# EAGLE design QFP64 breakout (EAGLE 5.11)
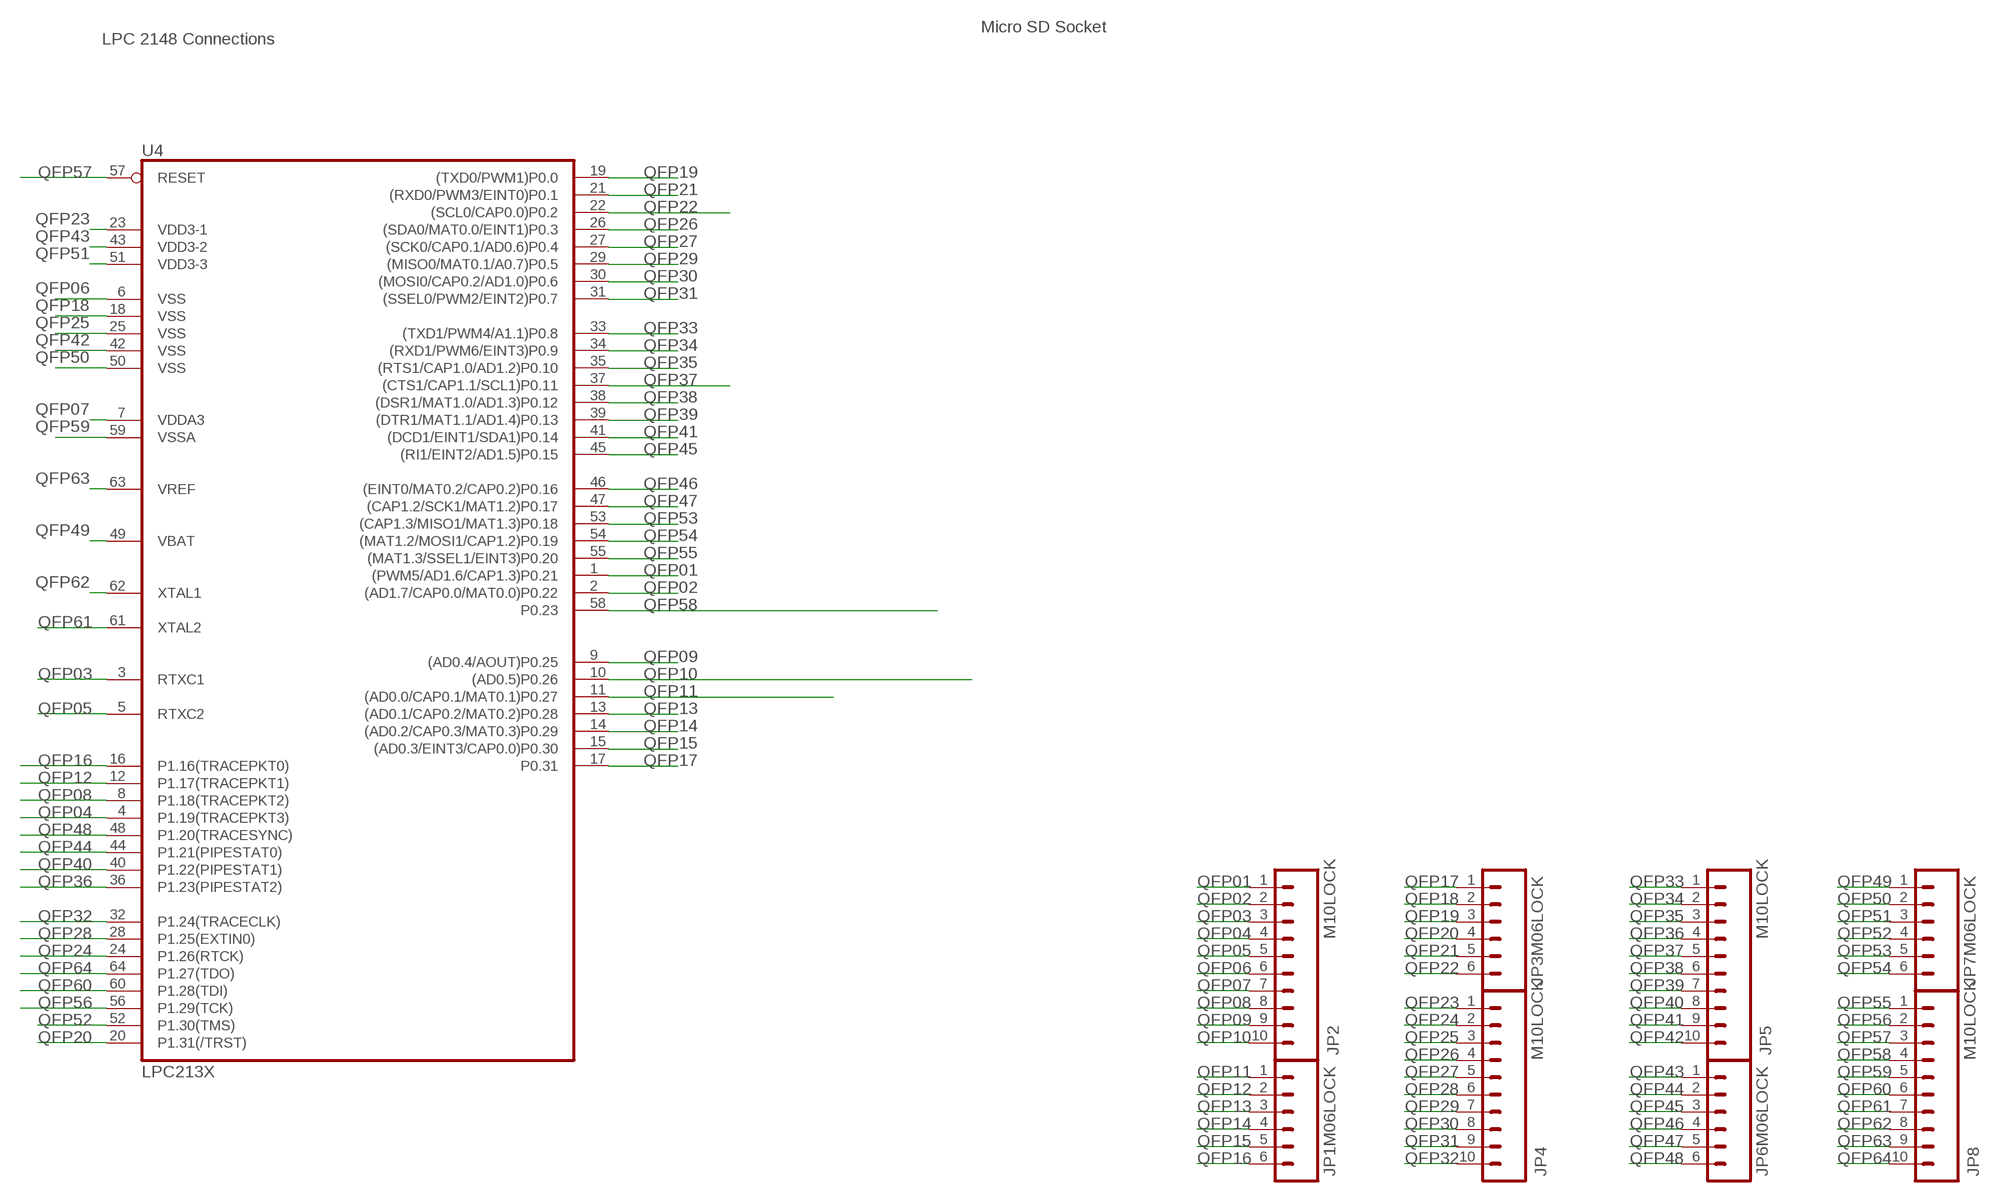
[diagram p0: schematic, sheet 1]

## Parts
JP1  M06LOCK  [1X06_LOCK]
JP2  M10LOCK  [1X10_LOCK]
JP3  M06LOCK  [1X06_LOCK]
JP4  M10LOCK  [1X10_LOCK]
JP5  M10LOCK  [1X10_LOCK]
JP6  M06LOCK  [1X06_LOCK]
JP7  M06LOCK  [1X06_LOCK]
JP8  M10LOCK  [1X10_LOCK]
U4  LPC213X  [SQFP-S-10X10-64]

## Nets
QFP01: JP2.1 U4.1((PWM5/AD1.6/CAP1.3)P0.21)
QFP02: JP2.2 U4.2((AD1.7/CAP0.0/MAT0.0)P0.22)
QFP03: JP2.3 U4.3(RTXC1)
QFP04: JP2.4 U4.4(P1.19(TRACEPKT3))
QFP05: JP2.5 U4.5(RTXC2)
QFP06: JP2.6 U4.6(VSS)
QFP07: JP2.7 U4.7(VDDA3)
QFP08: JP2.8 U4.8(P1.18(TRACEPKT2))
QFP09: JP2.9 U4.9((AD0.4/AOUT)P0.25)
QFP10: JP2.10 U4.10((AD0.5)P0.26)
QFP11: JP1.1 U4.11((AD0.0/CAP0.1/MAT0.1)P0.27)
QFP12: JP1.2 U4.12(P1.17(TRACEPKT1))
QFP13: JP1.3 U4.13((AD0.1/CAP0.2/MAT0.2)P0.28)
QFP14: JP1.4 U4.14((AD0.2/CAP0.3/MAT0.3)P0.29)
QFP15: JP1.5 U4.15((AD0.3/EINT3/CAP0.0)P0.30)
QFP16: JP1.6 U4.16(P1.16(TRACEPKT0))
QFP17: JP3.1 U4.17(P0.31)
QFP18: JP3.2 U4.18(VSS)
QFP19: JP3.3 U4.19((TXD0/PWM1)P0.0)
QFP20: JP3.4 U4.20(P1.31(/TRST))
QFP21: JP3.5 U4.21((RXD0/PWM3/EINT0)P0.1)
QFP22: JP3.6 U4.22((SCL0/CAP0.0)P0.2)
QFP23: JP4.1 U4.23(VDD3-1)
QFP24: JP4.2 U4.24(P1.26(RTCK))
QFP25: JP4.3 U4.25(VSS)
QFP26: JP4.4 U4.26((SDA0/MAT0.0/EINT1)P0.3)
QFP27: JP4.5 U4.27((SCK0/CAP0.1/AD0.6)P0.4)
QFP28: JP4.6 U4.28(P1.25(EXTIN0))
QFP29: JP4.7 U4.29((MISO0/MAT0.1/A0.7)P0.5)
QFP30: JP4.8 U4.30((MOSI0/CAP0.2/AD1.0)P0.6)
QFP31: JP4.9 U4.31((SSEL0/PWM2/EINT2)P0.7)
QFP32: JP4.10 U4.32(P1.24(TRACECLK))
QFP33: JP5.1 U4.33((TXD1/PWM4/A1.1)P0.8)
QFP34: JP5.2 U4.34((RXD1/PWM6/EINT3)P0.9)
QFP35: JP5.3 U4.35((RTS1/CAP1.0/AD1.2)P0.10)
QFP36: JP5.4 U4.36(P1.23(PIPESTAT2))
QFP37: JP5.5 U4.37((CTS1/CAP1.1/SCL1)P0.11)
QFP38: JP5.6 U4.38((DSR1/MAT1.0/AD1.3)P0.12)
QFP39: JP5.7 U4.39((DTR1/MAT1.1/AD1.4)P0.13)
QFP40: JP5.8 U4.40(P1.22(PIPESTAT1))
QFP41: JP5.9 U4.41((DCD1/EINT1/SDA1)P0.14)
QFP42: JP5.10 U4.42(VSS)
QFP43: JP6.1 U4.43(VDD3-2)
QFP44: JP6.2 U4.44(P1.21(PIPESTAT0))
QFP45: JP6.3 U4.45((RI1/EINT2/AD1.5)P0.15)
QFP46: JP6.4 U4.46((EINT0/MAT0.2/CAP0.2)P0.16)
QFP47: JP6.5 U4.47((CAP1.2/SCK1/MAT1.2)P0.17)
QFP48: JP6.6 U4.48(P1.20(TRACESYNC))
QFP49: JP7.1 U4.49(VBAT)
QFP50: JP7.2 U4.50(VSS)
QFP51: JP7.3 U4.51(VDD3-3)
QFP52: JP7.4 U4.52(P1.30(TMS))
QFP53: JP7.5 U4.53((CAP1.3/MISO1/MAT1.3)P0.18)
QFP54: JP7.6 U4.54((MAT1.2/MOSI1/CAP1.2)P0.19)
QFP55: JP8.1 U4.55((MAT1.3/SSEL1/EINT3)P0.20)
QFP56: JP8.2 U4.56(P1.29(TCK))
QFP57: JP8.3 U4.57(RESET)
QFP58: JP8.4 U4.58(P0.23)
QFP59: JP8.5 U4.59(VSSA)
QFP60: JP8.6 U4.60(P1.28(TDI))
QFP61: JP8.7 U4.61(XTAL2)
QFP62: JP8.8 U4.62(XTAL1)
QFP63: JP8.9 U4.63(VREF)
QFP64: JP8.10 U4.64(P1.27(TDO))

## Notes on the sheet
- Micro SD Socket
- LPC 2148 Connections

## Library data of the parts
JP1 JP3 JP6 JP7 = SparkFun:M06: Header 6 Standard 6-pin 0.1" header. Use with straight break away headers (SKU : PRT-00116), right angle break away headers (PRT-00553), swiss pins (PRT-00743), machine pins (PRT-00117), and female headers (PRT-00115). Molex polarized connector foot print use with SKU : PRT-08094 with associated crimp pins and housings. NOTES ON THE VARIANTS LOCK and LOCK_LONGPADS... This footprint was designed to help hold the alignment of a through-hole component (i.e. 6-pin header) while soldering it into place. You may notice that each hole has been shifted either up or down by 0.005 of an inch from it's more standard position (which is a perfectly straight line). This slight alteration caused the pins (the squares in the middle) to touch the edges of the holes. Because they are alternating, it causes a "brace" to hold the component in place. 0.005 has proven to be the perfect amount of "off-center" position when using our standard breakaway headers. Although looks a little odd when you look at the bare footprint, once you have a header in there, the alteration is very hard to notice. Also, if you push a header all the way into place, it is covered up entirely on the bottom side. This idea of altering the position of holes to aid alignment will be further integrated into the Sparkfun Library for other footprints. It can help hold any component with 3 or more connection pins.
JP2 JP4 JP5 JP8 = SparkFun:M10: Header 10 Standard 10-pin 0.1" header. Use with straight break away headers (SKU : PRT-00116), right angle break away headers (PRT-00553), swiss pins (PRT-00743), machine pins (PRT-00117), and female headers (PRT-00115).
U4 = SparkFun:LPC213X: LPC213x Schematic element and footprint for NXP LPC213x. Spark Fun Electronics SKU : COM-00520

## Net classes
0 default: width 0.178 mm
1 power: width 0.203 mm
2 hv: width 0.254 mm, clearance 0.229 mm

## Board
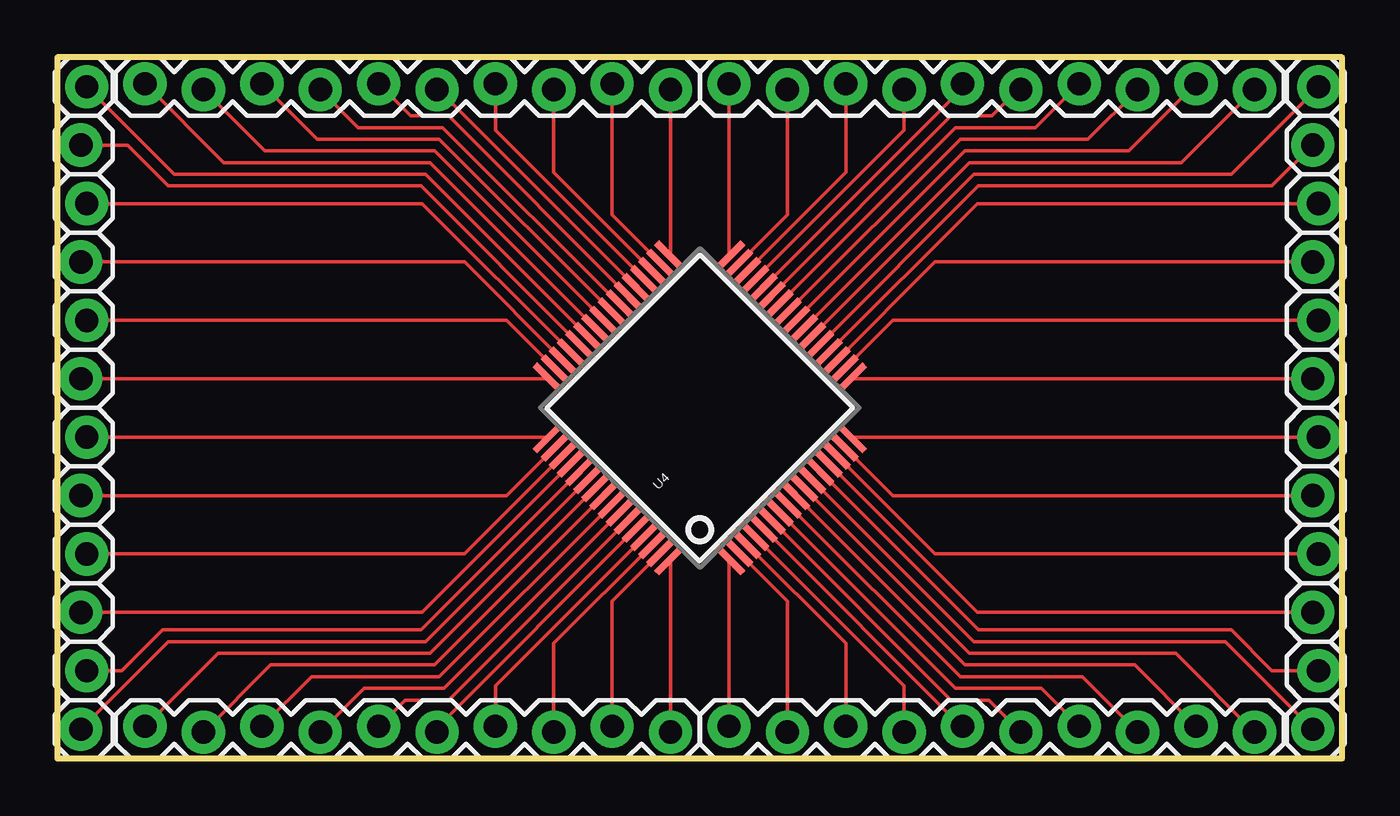
[diagram p1: board, top side]

Size 55.88 x 30.48 mm. Coordinates in mm from the lower left corner, seen from the top.
Outline: 0,0 55.88,0 55.88,30.48 0,30.48 0,0
Copper layers (1*16): Top 0.0356mm / dielectric 1.5011mm / Bottom 0.0356mm
Design rules "LaenPCBOrder": minimum track width 6mil, minimum drill 13mil, track to track 6mil, track to pad 6mil, pad to pad 6mil, via to via 6mil, smd to smd 6mil, copper to edge 15mil, drill to drill 6mil, minimum pad ring 7mil, minimum via ring 7mil, stop-mask expansion 4mil, vias tented up to drill 0mil, thermal gap 10mil

### Footprints (pad centres in the part's own frame; a part is rotated, then mirrored left to right if it is on the bottom)
1X06_LOCK = drill 1.016 pad 1.88 round: 1 0,0; 2 2.54,-0.254; 3 5.08,0; 4 7.62,-0.254; 5 10.16,0; 6 12.7,-0.254
1X10_LOCK = drill 1.016 pad 1.88 round: 1 0,0.127; 2 2.54,-0.127; 3 5.08,0.127; 4 7.62,-0.127; 5 10.16,0.127; 6 12.7,-0.127; 7 15.24,0.127; 8 17.78,-0.127; 9 20.32,0.127; 10 22.86,-0.127
SQFP-S-10X10-64 = smd 0.3 x 1.6: 1 -3.75,-5.6; 2 -3.25,-5.6; 3 -2.75,-5.6; 4 -2.25,-5.6; 5 -1.75,-5.6; 6 -1.25,-5.6; 7 -0.75,-5.6; 8 -0.25,-5.6; 9 0.25,-5.6; 10 0.75,-5.6; 11 1.25,-5.6; 12 1.75,-5.6; 13 2.25,-5.6; 14 2.75,-5.6; 15 3.25,-5.6; 16 3.75,-5.6; 33 3.75,5.6; 34 3.25,5.6; 35 2.75,5.6; 36 2.25,5.6; 37 1.75,5.6; 38 1.25,5.6; 39 0.75,5.6; 40 0.25,5.6; 41 -0.25,5.6; 42 -0.75,5.6; 43 -1.25,5.6; 44 -1.75,5.6; 45 -2.25,5.6; 46 -2.75,5.6; 47 -3.25,5.6; 48 -3.75,5.6 | smd 1.6 x 0.3: 17 5.6,-3.75; 18 5.6,-3.25; 19 5.6,-2.75; 20 5.6,-2.25; 21 5.6,-1.75; 22 5.6,-1.25; 23 5.6,-0.75; 24 5.6,-0.25; 25 5.6,0.25; 26 5.6,0.75; 27 5.6,1.25; 28 5.6,1.75; 29 5.6,2.25; 30 5.6,2.75; 31 5.6,3.25; 32 5.6,3.75; 49 -5.6,3.75; 50 -5.6,3.25; 51 -5.6,2.75; 52 -5.6,2.25; 53 -5.6,1.75; 54 -5.6,1.25; 55 -5.6,0.75; 56 -5.6,0.25; 57 -5.6,-0.25; 58 -5.6,-0.75; 59 -5.6,-1.25; 60 -5.6,-1.75; 61 -5.6,-2.25; 62 -5.6,-2.75; 63 -5.6,-3.25; 64 -5.6,-3.75

### Placement (x,y rotation side)
JP1  54.61,1.27 90 top
JP2  29.21,1.27 0 top
JP3  54.61,16.51 90 top
JP4  52.07,29.21 180 top
JP5  26.67,29.21 180 top
JP6  1.27,29.21 270 top
JP7  1.27,13.97 270 top
JP8  3.81,1.27 0 top
U4  27.94,15.24 45 top

### Tracks (layer width: path | path; a pad name or v marks a point on that pad's centre or on a via)
QFP01
  Top 0.152: U4.1 29.21,8.63 JP2.1
QFP02
  Top 0.152: U4.2 31.75,6.83 JP2.2
QFP03
  Top 0.152: U4.3 34.29,5 JP2.3
QFP04
  Top 0.152: U4.4 36.83,3.17 JP2.4
QFP05
  Top 0.152: U4.5 39.31,1.4 JP2.5
QFP06
  Top 0.152: U4.6 38.87,2.54 40.51,2.54 JP2.6
QFP07
  Top 0.152: U4.7 39.07,3.05 42.8,3.05 JP2.7
QFP08
  Top 0.152: U4.8 39.27,3.56 44.58,3.56 JP2.8
QFP09
  Top 0.152: U4.9 39.47,4.06 46.86,4.06 JP2.9
QFP10
  Top 0.152: U4.10 39.67,4.57 48.64,4.57 JP2.10
QFP11
  Top 0.152: U4.11 39.87,5.08 50.8,5.08 JP1.1
QFP12
  Top 0.152: U4.12 40.07,5.59 51.05,5.59 52.83,3.81 JP1.2
QFP13
  Top 0.152: U4.13 40.01,6.35 JP1.3
QFP14
  Top 0.152: U4.14 38.18,8.89 JP1.4
QFP15
  Top 0.152: U4.15 36.35,11.43 JP1.5
QFP16
  Top 0.152: U4.16 34.59,13.97 JP1.6
QFP17
  Top 0.152: U4.17 34.59,16.51 JP3.1
QFP18
  Top 0.152: U4.18 36.35,19.05 JP3.2
QFP19
  Top 0.152: U4.19 38.18,21.59 JP3.3
QFP20
  Top 0.152: U4.20 40.01,24.13 JP3.4
QFP21
  Top 0.152: U4.21 40.07,24.89 52.83,24.89 JP3.5
QFP22
  Top 0.152: U4.22 39.87,25.4 51.05,25.4 JP3.6
QFP23
  Top 0.152: U4.23 39.67,25.91 48.9,25.91 JP4.1
QFP24
  Top 0.152: U4.24 39.47,26.42 46.61,26.42 JP4.2
QFP25
  Top 0.152: U4.25 39.27,26.92 44.83,26.92 JP4.3
QFP26
  Top 0.152: U4.26 39.07,27.43 42.55,27.43 JP4.4
QFP27
  Top 0.152: U4.27 38.87,27.94 40.64,27.94 41.78,29.08 JP4.5
QFP28
  Top 0.152: U4.28 39.37,29.14 JP4.6
QFP29
  Top 0.152: U4.29 36.83,27.31 JP4.7
QFP30
  Top 0.152: U4.30 34.29,25.48 JP4.8
QFP31
  Top 0.152: U4.31 31.75,23.65 JP4.9
QFP32
  Top 0.152: U4.32 29.21,21.89 JP4.10
QFP33
  Top 0.152: U4.33 26.67,21.89 JP5.1
QFP34
  Top 0.152: U4.34 24.13,23.65 JP5.2
QFP35
  Top 0.152: U4.35 21.59,25.48 JP5.3
QFP36
  Top 0.152: U4.36 19.05,27.31 JP5.4
QFP37
  Top 0.152: U4.37 16.57,29.08 JP5.5
QFP38
  Top 0.152: U4.38 17.01,27.94 15.37,27.94 JP5.6
QFP39
  Top 0.152: JP5.7 13.08,27.43 16.76,27.43 24.47,19.73 U4.39
QFP40
  Top 0.152: U4.40 16.61,26.92 11.3,26.92 JP5.8
QFP41
  Top 0.152: U4.41 16.41,26.42 9.02,26.42 JP5.9
QFP42
  Top 0.152: U4.42 16.21,25.91 7.24,25.91 JP5.10
QFP43
  Top 0.152: U4.43 16.01,25.4 5.08,25.4 JP6.1
QFP44
  Top 0.152: U4.44 15.81,24.89 4.83,24.89 3.05,26.67 JP6.2
QFP45
  Top 0.152: U4.45 15.87,24.13 JP6.3
QFP46
  Top 0.152: U4.46 17.7,21.59 JP6.4
QFP47
  Top 0.152: U4.47 19.53,19.05 JP6.5
QFP48
  Top 0.152: U4.48 21.29,16.51 JP6.6
QFP49
  Top 0.152: U4.49 21.29,13.97 JP7.1
QFP50
  Top 0.152: U4.50 19.53,11.43 JP7.2
QFP51
  Top 0.152: U4.51 17.7,8.89 JP7.3
QFP52
  Top 0.152: U4.52 15.87,6.35 JP7.4
QFP53
  Top 0.152: U4.53 15.81,5.59 4.57,5.59 2.79,3.81 JP7.5
QFP54
  Top 0.152: U4.54 16.01,5.08 4.83,5.08 JP7.6
QFP55
  Top 0.152: U4.55 16.21,4.57 6.99,4.57 JP8.1
QFP56
  Top 0.152: U4.56 16.41,4.06 9.27,4.06 JP8.2
QFP57
  Top 0.152: U4.57 16.61,3.56 11.05,3.56 JP8.3
QFP58
  Top 0.152: U4.58 16.81,3.05 13.34,3.05 JP8.4
QFP59
  Top 0.152: U4.59 17.01,2.54 15.11,2.54 JP8.5
QFP60
  Top 0.152: U4.60 16.51,1.33 JP8.6
QFP61
  Top 0.152: U4.61 19.05,3.17 JP8.7
QFP62
  Top 0.152: U4.62 21.59,5 JP8.8
QFP63
  Top 0.152: U4.63 24.13,6.83 JP8.9
QFP64
  Top 0.152: U4.64 26.67,8.63 JP8.10